# EAGLE schematic schematic (EAGLE 6.6.0)
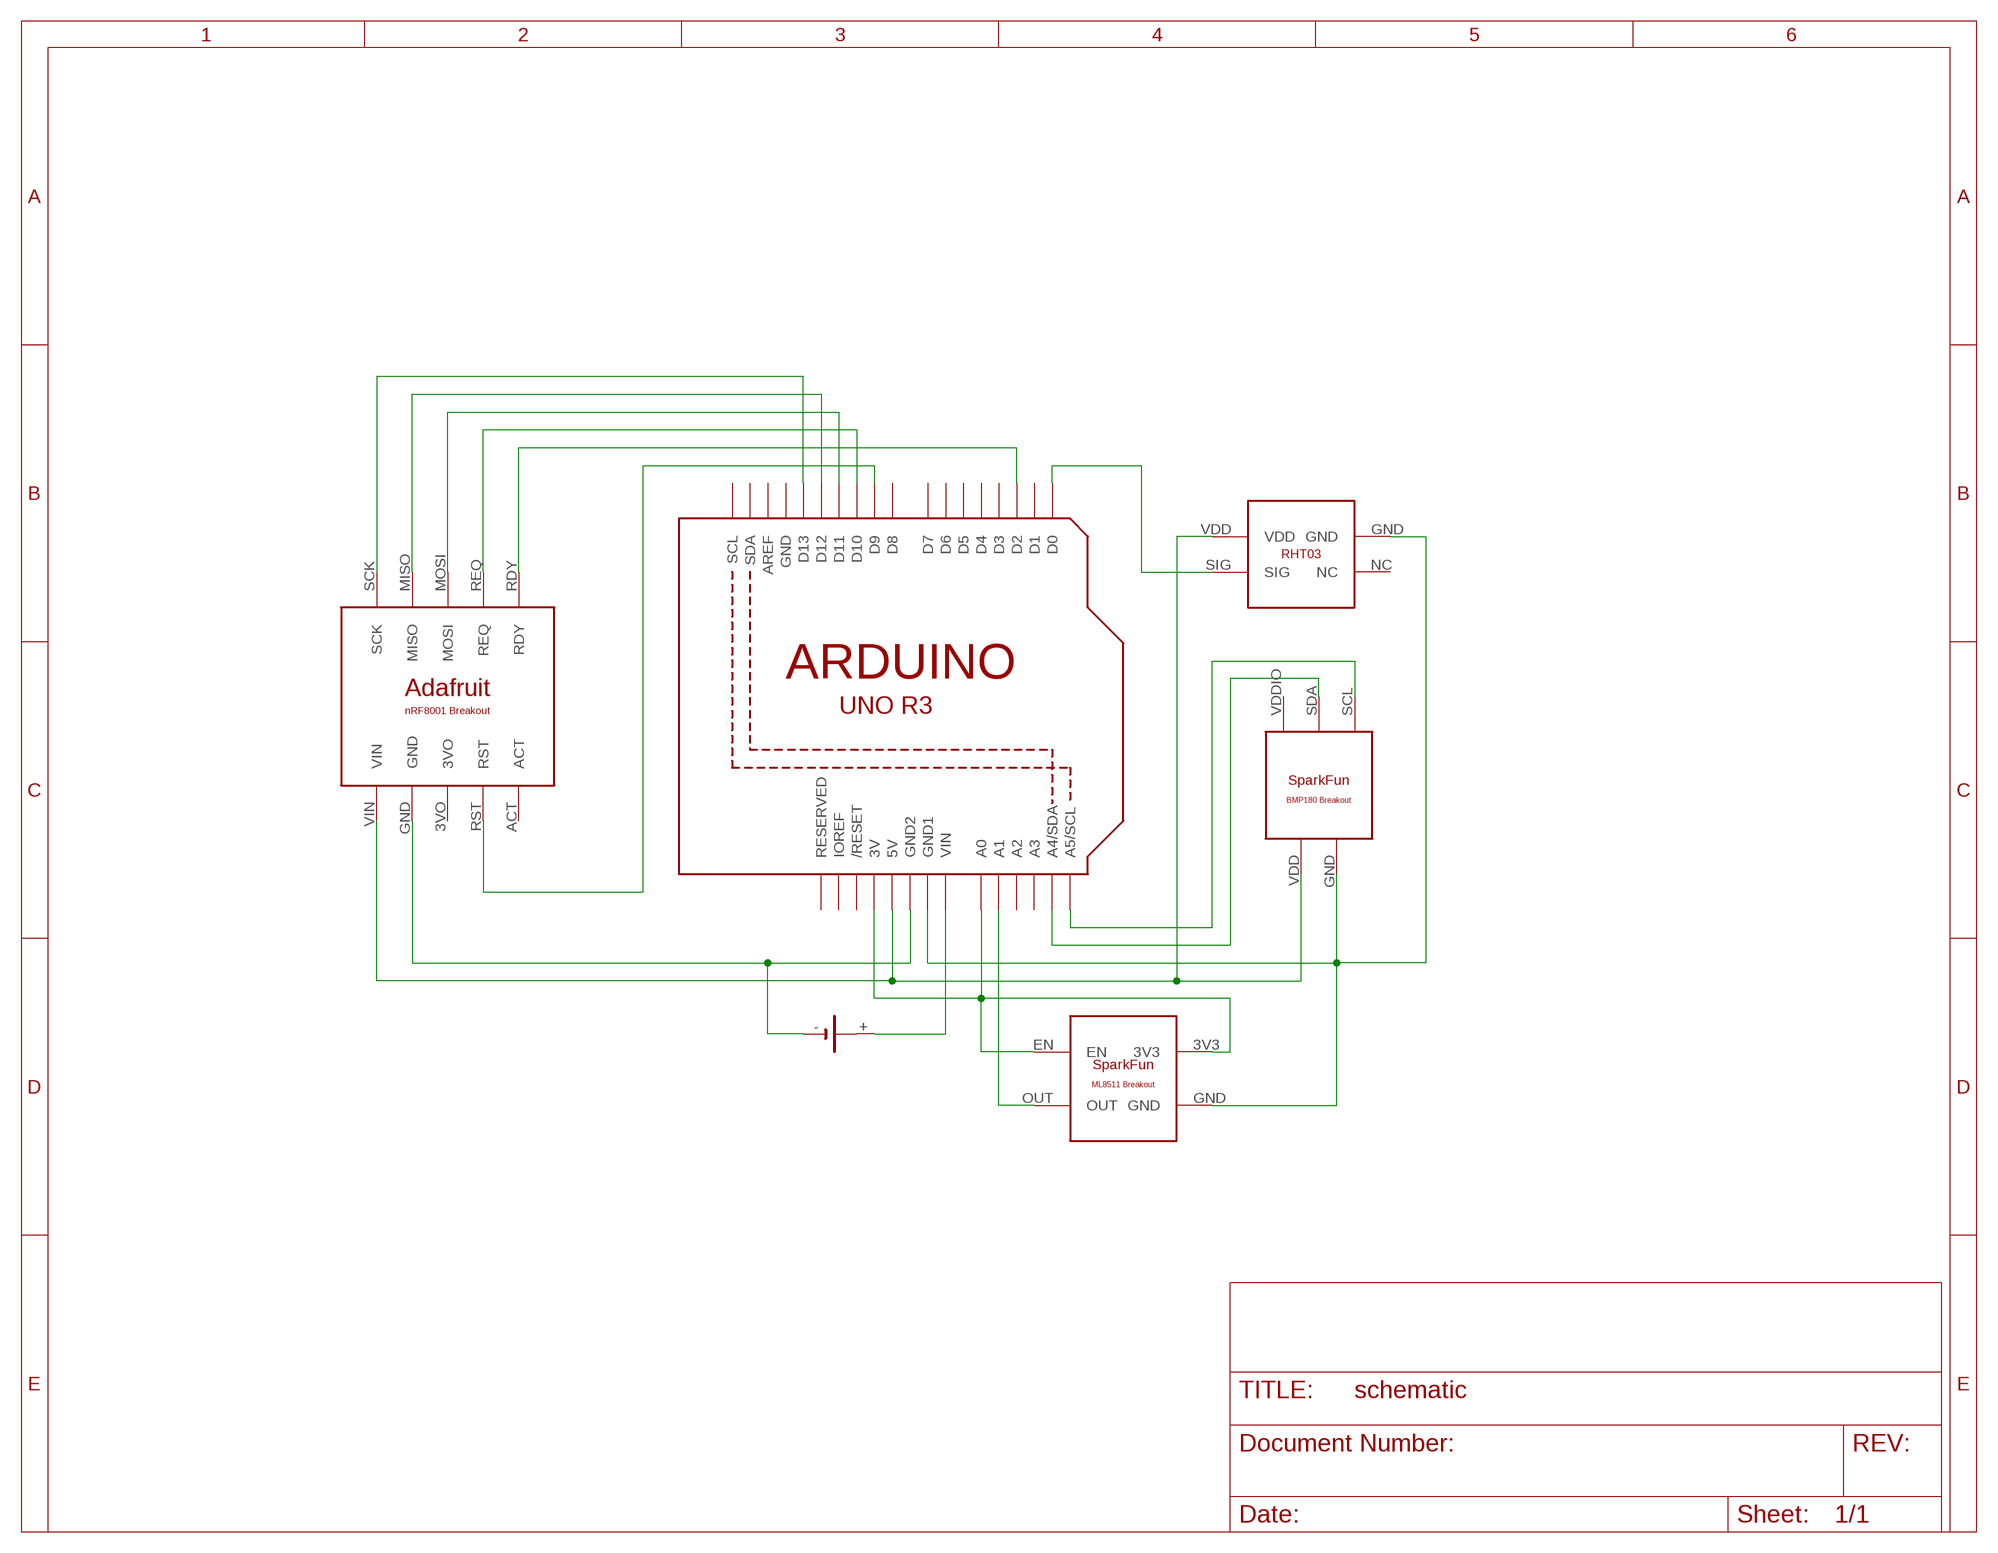
[diagram p0: schematic, sheet 1]

## Parts
BAT  1V60R  [1V60R]
U1  ARDUINOR3-DIMENSION  [ARDUINOR3]
U$1  ADAFRUIT_NRF8001_BREAKOUT  [ADAFRUIT_NRF8001_BREAKOUT_HEADERS]
U$2  SPARKFUN_BMP180_BREAKOUT  [SPARKFUN_BMP180_BREAKOUT_HEADERS]
U$3  RHT03  [RHT03_HEADERS]
U$4  SPARKFUN_ML8511_BREAKOUT  [SPARKFUN_ML8511_BREAKOUT_HEADERS]

## Nets
N$1: BAT.+ U1.VIN
N$3: U1.5V U$1.VIN U$2.VDD U$3.VDD
N$4: U1.A1 U$4.OUT
N$5: U1.D13 U$1.SCK
N$6: U1.D12 U$1.MISO
N$7: U1.D11 U$1.MOSI
N$8: U1.D10 U$1.REQ
N$9: U1.D2 U$1.RDY
N$10: U1.D9 U$1.RST
N$11: U1.A4(A4/SDA) U$2.SDA
N$12: U1.A5(A5/SCL) U$2.SCL
N$13: U1.GND1 U$2.GND U$3.GND U$4.GND
N$14: U1.D0 U$3.SIG
N$15: U1.3V U1.A0 U$4.3V3 U$4.EN
N$16: BAT.- U1.GND2 U$1.GND
Unconnected: BAT.+@1(+) U1.A2 U1.A3 U1.AREF U1.D1 U1.D3 U1.D4 U1.D5 U1.D6 U1.D7 U1.D8 U1.IOREF U1.RESERVED U1.RESET(/RESET) U1.SCL U1.SDA U$1.3VO U$1.ACT U$2.VDDIO U$3.NC

## Power pins joined to a net without a drawn wire
GND: U1.GND

## Library data of the parts
BAT = battery:1V60R: NC ACCU Varta
U1 = adafruit:ARDUINOR3: This is a new object for the new Arduino R3 - with extra pins that you may want to use (such as IOref, and duplicated A4/A5
U$1 = parts:ADAFRUIT_NRF8001_BREAKOUT
U$2 = parts:SPARKFUN_BMP180_BREAKOUT
U$3 = parts:RHT03
U$4 = parts:SPARKFUN_ML8511_BREAKOUT